# EAGLE schematic power_supply (EAGLE 9.6.2)
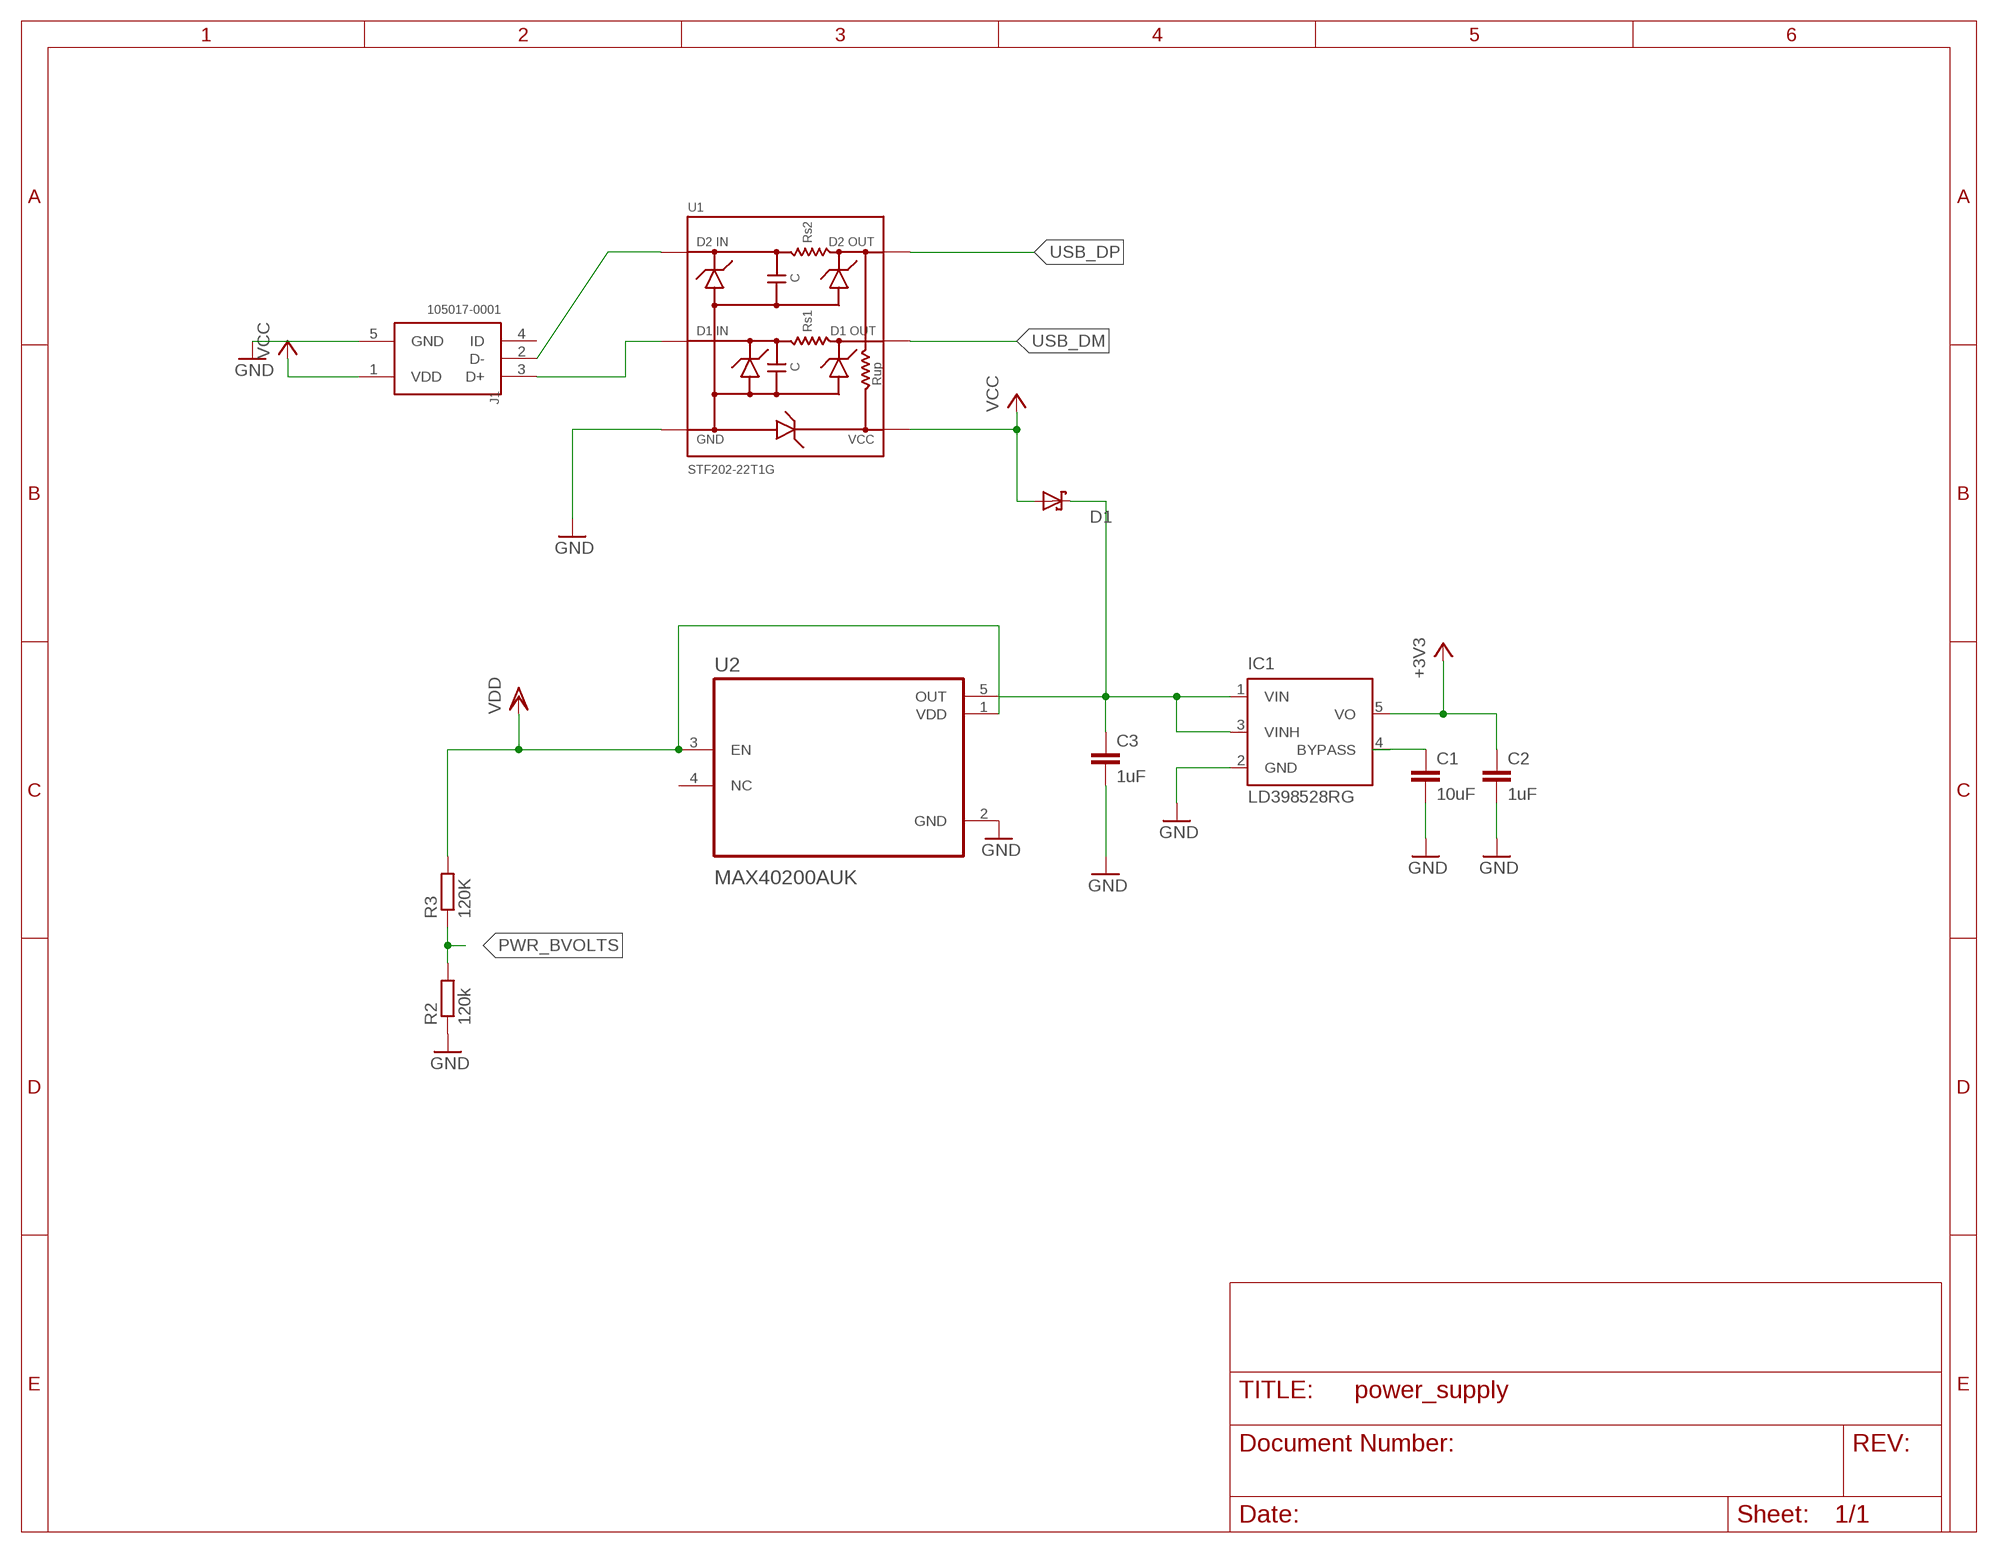
[diagram p0: schematic, sheet 1]

## Parts
C1  10uF  C-EUC0603  [C0603]
C2  1uF  C-EUC0603  [C0603]
C3  1uF  C-EUC0603  [C0603]
D1  SCHOTTKY-DIODEDFLS130L-7  [POWERDI-123]
IC1  LD398528RG  [TSOT23-5L]
J1  105017-0001  [MOLEX_105017-0001]
R2  120k  R-EU_R0603  [R0603]
R3  120K  R-EU_R0603  [R0603]
U1  STF202-22T1G  [STF202-22T1G]
U2  MAX40200AUK  [21-0057F]

## Nets
+3V1: C3.1 D1.C IC1.1(VIN) IC1.3(VINH) U2.5(OUT)
+3V3: C2.1 IC1.5(VO)
GND: C1.2 C2.2 C3.2 IC1.2(GND) J1.5(GND) R2.1 U1.6(GND) U2.2(GND)
N$2: J1.2(D-) U1.4(D2-OUT)
N$6: C1.1 IC1.4(BYPASS)
PWR_BVOLTS: R2.2 R3.1
USB_DM: U1.2(D1-IN)
USB_DP: J1.3(D+) U1.3(D2-IN) U1.5(D1-OUT)
VCC: D1.A J1.1(VDD) U1.1(VCC)
VDD: R3.2 U2.1(VDD) U2.3(EN)
Unconnected: J1.4(ID) U2.4(NC)

## Library data of the parts
C1-C3 = rcl:C-EU: CAPACITOR, European symbol; SPICEPREFIX: C
D1 = dfls130l-7:SCHOTTKY-DIODE: Schottky Diode; MF: Diodes Inc; MOUSER: 621-DFLS130L; MPN: DFLS130L-7
IC1 = st-microelectronics:LD3985: Ultra low drop and low noise BiCMOS voltage regulators Source: www.st.com LD3985.pdf
J1 = 105017-0001:105017-0001: Check prices <https://pricing.snapeda.com/parts/105017-0001/Molex/view-part?ref=eda>; AVAILABILITY: In Stock; DESCRIPTION: USB - micro B USB 2.0 Receptacle Connector 5 Position Surface Mount, Right Angle; Through Hole; MF: Molex; MP: 105017-0001; PACKAGE: None; PRICE: None; PURCHASE-URL: https://pricing.snapeda.com/search/part/105017-0001/?ref=eda
R2 R3 = rcl:R-EU_: RESISTOR, European symbol; SPICEPREFIX: R
U1 = STF202-22T1G:STF202-22T1G: Check prices <https://pricing.snapeda.com/parts/STF202-22T1G/ON%20Semiconductor/view-part?ref=eda>; AVAILABILITY: In Stock; DESCRIPTION: RC (Pi) EMI Filter 2nd Order Low Pass 2 Channel R = 22Ohms, C = 68pF SC-74, SOT-457; MF: ON Semiconductor; MP: STF202-22T1G; PACKAGE: TSOP-6 ON Semiconductor; PRICE: None; PURCHASE-URL: https://pricing.snapeda.com/search/part/STF202-22T1G/?ref=eda
U2 = MAX40200AUK:MAX40200AUK: None Check prices <https://pricing.snapeda.com/parts/MAX40200AUK/Maxim%20Integrated/view-part?ref=eda>; AVAILABILITY: In Stock; DESCRIPTION: IC DIODE CURRENT SWITCH SOT23-5; MF: Maxim Integrated; MP: MAX40200AUK; PACKAGE: None; PRICE: None